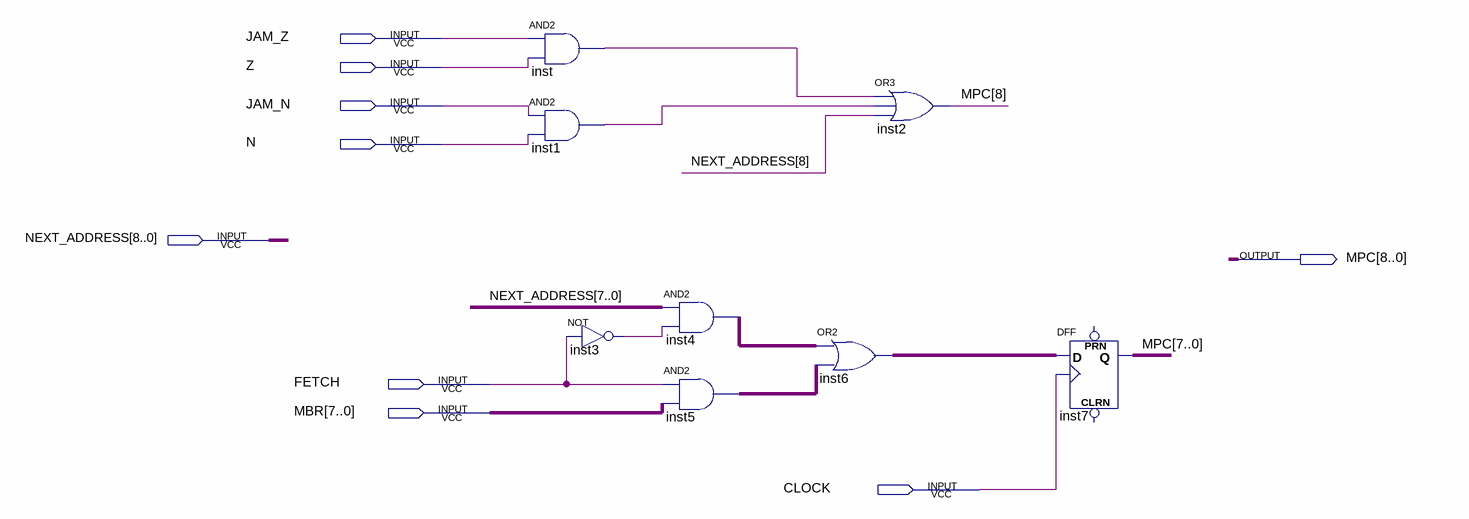
[diagram p0: schematic sheet]
// Quartus schematic MPC.bdf as structural Verilog: 8 symbols, 9 pins
module MPC (
  input  JAM_Z,
  input  Z,
  input  JAM_N,
  input  N,
  input  [8:0] NEXT_ADDRESS,
  input  FETCH,
  input  [7:0] MBR,
  input  CLOCK,
  output [8:0] MPC
);

  wire inst1_out, inst3_out, inst_out;
  wire [7:0] inst4_out, inst5_out, inst6_out;

  and inst (inst_out, JAM_Z, Z);
  and inst1 (inst1_out, JAM_N, N);
  not inst3 (inst3_out, FETCH);
  assign inst4_out = NEXT_ADDRESS[7:0] & {8{inst3_out}};  // AND2 inst4, 8 bits wide
  assign inst5_out = {8{FETCH}} & MBR;  // AND2 inst5, 8 bits wide
  assign inst6_out = inst4_out | inst5_out;  // OR2 inst6, 8 bits wide
  or inst2 (MPC[8], inst_out, inst1_out, NEXT_ADDRESS[8]);
  DFF inst7[7:0] (.CLK(CLOCK), .D(inst6_out), .Q(MPC[7:0]));  // open: CLRN, PRN
endmodule
